# Altium schematic sheet [05] - CONTROL.SchDoc: Desk Digital Clock
size A4; DrawnBy: Ramil Teregulov; Address1: http://github.com/teregulov; Address2: http://github.com/teregulov/Desk-Digital-Clock; DocumentNumber: DDC-4; Revision: 1R0; SheetNumber: 4; SheetTotal: 7
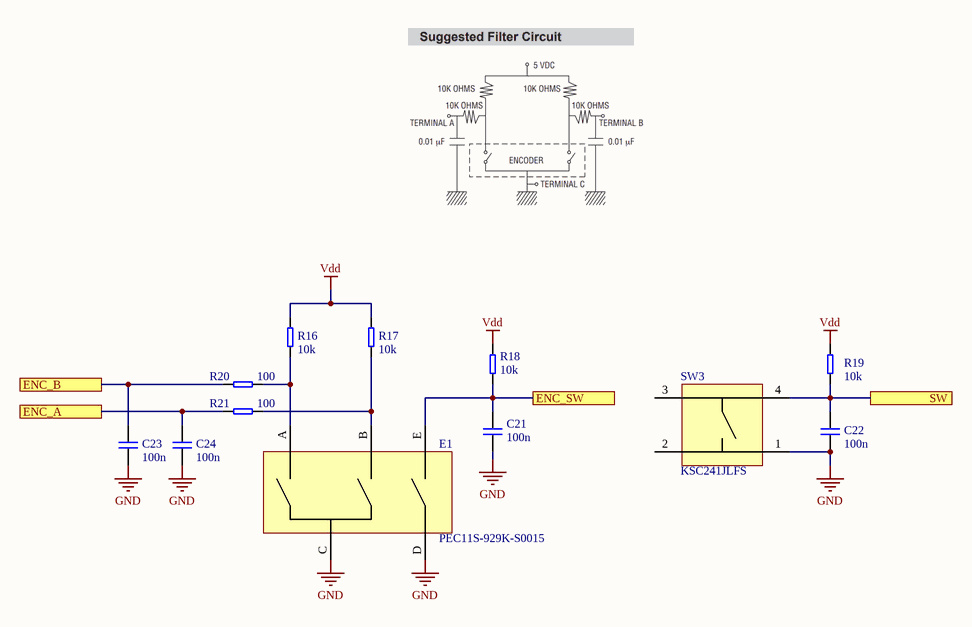
[diagram p0: [05] - CONTROL.SchDoc]

## Parts
C21  100n  [C0603]
C22  100n  [C0603]
C23  100n  [C0603]
C24  100n  [C0603]
E1  PEC11S-929K-S0015  [PEC11S-929K-S0015]
R16  10k  [R0603]
R17  10k  [R0603]
R18  10k  [R0603]
R19  10k  [R0603]
R20  100  [R0603]
R21  100  [R0603]
SW3  KSC241JLFS  [KSC241JLFS]

## Ports
ENC_A, ENC_B, ENC_SW, SW

## Nets
GND: C21.1 C22.1 C23.1 C24.1 E1.C E1.D SW3.1
Vdd: R16.2 R17.2 R18.2 R19.2
ENC_A: C24.2 R21.2 ; port ENC_A
ENC_B: C23.2 R20.2 ; port ENC_B
ENC_SW: C21.2 E1.E R18.1 ; port ENC_SW
SW: C22.2 R19.1 SW3.4 ; port SW
NetE1_A: E1.A R16.1 R20.1
NetE1_B: E1.B R17.1 R21.1

Not connected (* = marked no-connect by the designer): SW3 2 3

## Notes on the sheet
- Title:
- Size:
- Date:
- A4
- Number:
- Time:
- Revision:
- Sheet
- of
- File:

## Library data of the parts
C21-C24 = Cap: CAPACITOR; Value: 100n
E1 = PEC11S-929K-S0015: ROTARY ENCODER MECHANICAL 15PPR; Manufacturer: Bourns; P/N: PEC11S-929K-S0015; Datasheet: https://www.bourns.com/docs/product-datasheets/pec11s.pdf?sfvrsn=601089f1_5; Supplier 1: Aliexpress; Supplier Part Number 1: https://ru.aliexpress.com/item/32982414097.html?spm=a2g0o.productlist.0.0.66c8dd40JI3Wx0&algo_pvid=9a118981-c070-4602-89dc-e0076a1d9175&algo_expid=9a118981-c070-4602-89dc-e0076a1d9175-0&btsid=fce86d33-42b5-41e8-9f27-e9f4b1b87b22&ws_ab_test=searchweb0_0,searchweb201602_7,searchweb201603_52
R16-R21 = Res: RESISTOR
  R16-R19: Value: 10k
  R20 R21: Value: 100
SW3 = KSC241JLFS: SWITCH TACTILE SPST-NO 50mA @ 32VDC; Manufacturer: C&K; P/N: KSC241JLFS; Datasheet: https://www.ckswitches.com/media/1968/ksc2.pdf